# EAGLE design HE6-RORO2 (EAGLE 9.6.2)
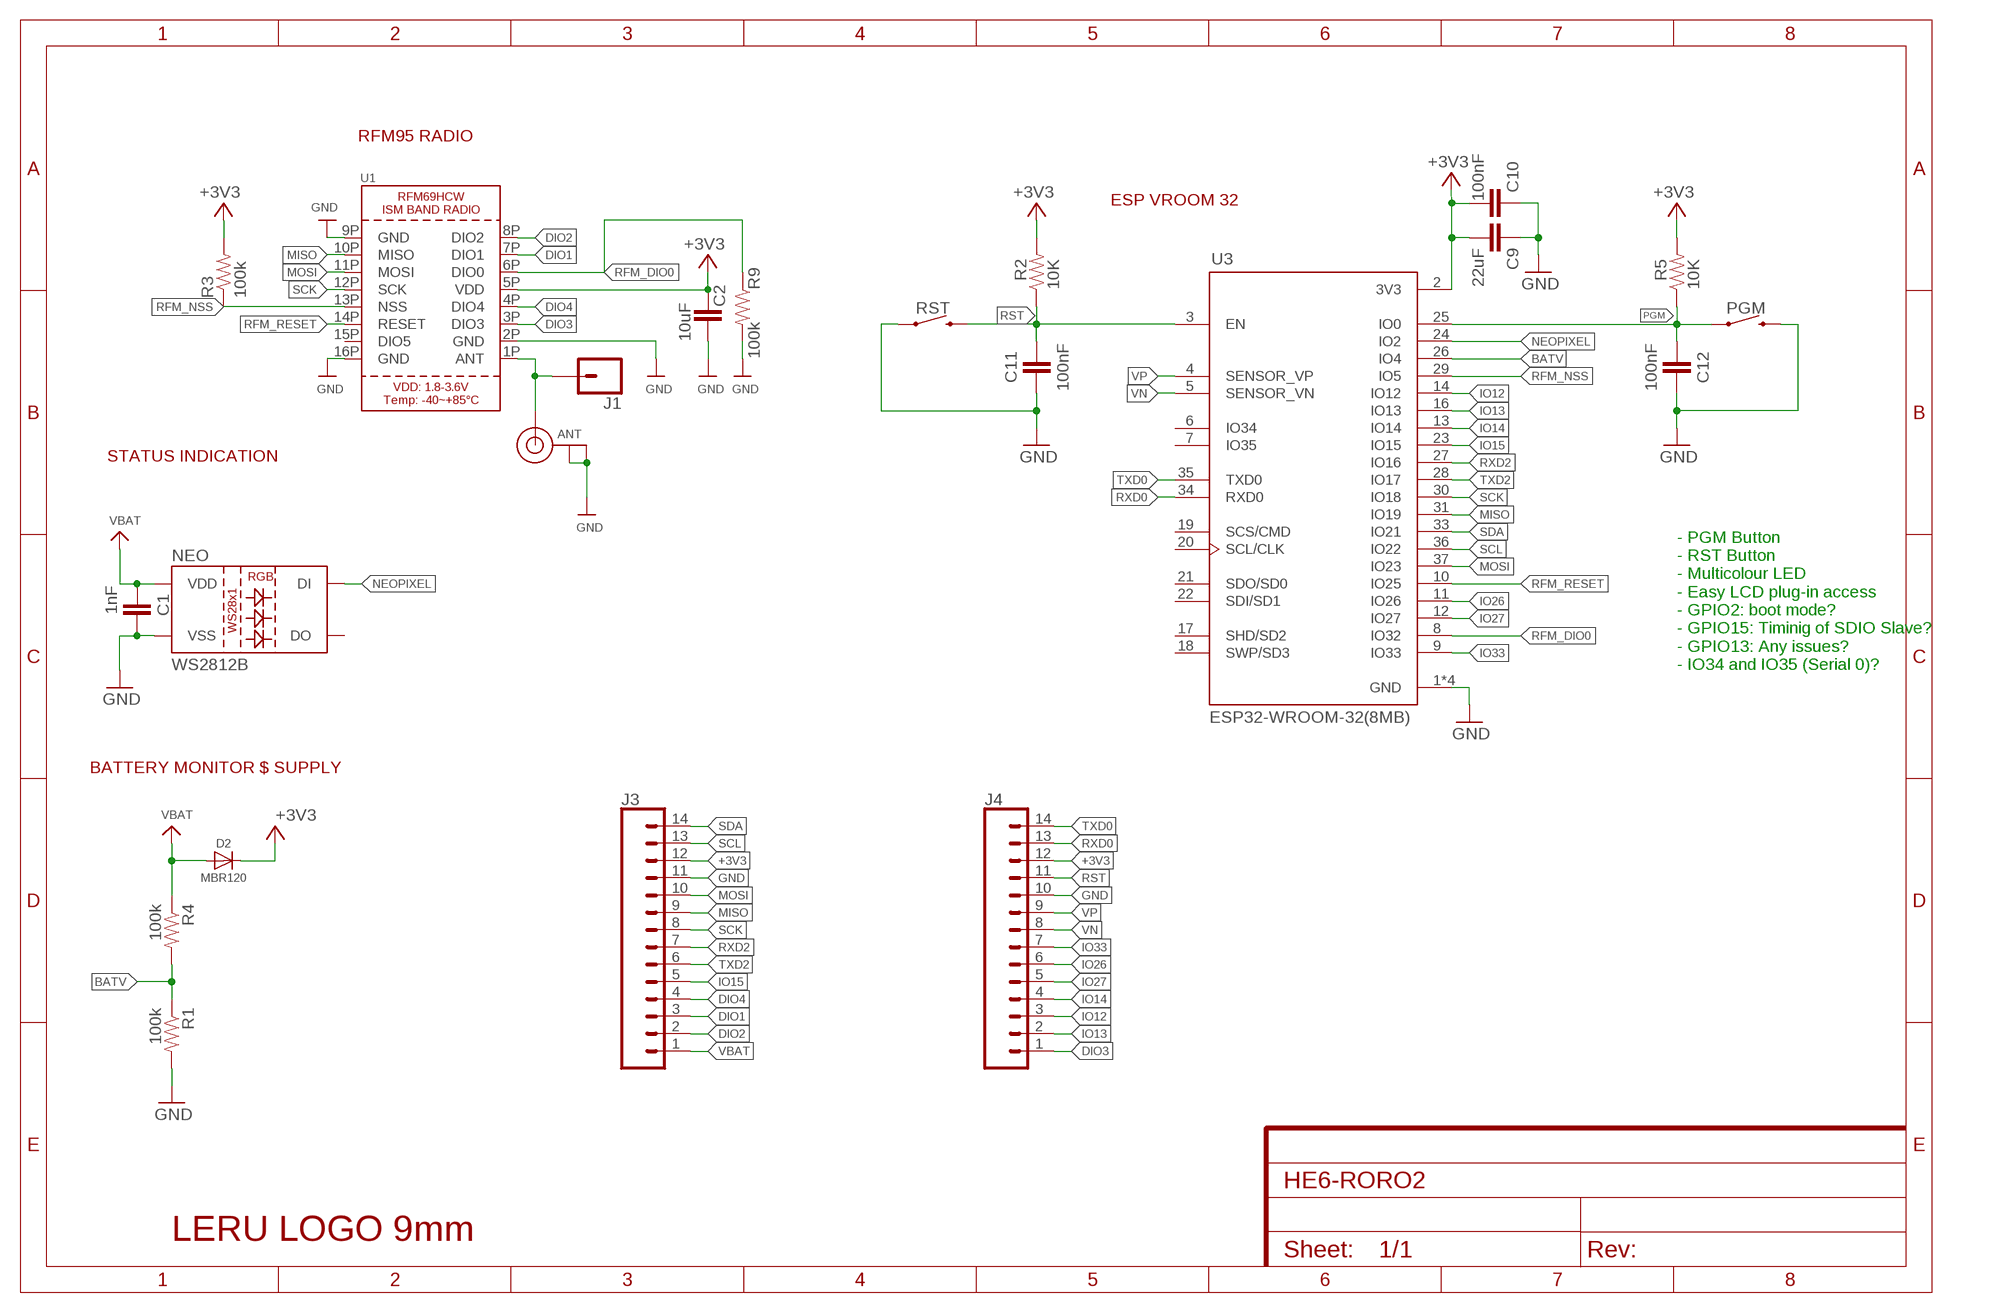
[diagram p0: schematic, sheet 1]

## Parts
ANT  MICROBUILDER_ANTENNA_U.FL  [MICROBUILDER_U.FL]
C1  1nF  CAP0805  [CAP]
C2  10uF  CAP0805  [CAP]
C9  22uF  CAP0805  [CAP]
C10  100nF  CAP0805  [CAP]
C11  100nF  CAP0805  [CAP]
C12  100nF  CAP0805  [CAP]
D2  MBR120  DIODESOD123  [DIODE]
J1  CONN_01PTH_NO_SILK_YES_STOP  [1X01_NO_SILK]
J3  CONN_14NO_SILK  [1X14_NO_SILK]
J4  CONN_14NO_SILK  [1X14_NO_SILK]
NEO  WS2812B  [WS2812B]
PGM  MOMENTARY-SWITCH-SPST-SMD-RIGHT-ANGLE  [TACTILE_SWITCH_SMD_RIGHT_ANGLE]
R1  100k  RES0805-RES  [RES]
R2  10K  RES0805-RES  [RES]
R3  100k  RES0805-RES  [RES]
R4  100k  RES0805-RES  [RES]
R5  10K  RES0805-RES  [RES]
R9  100k  RES0805-RES  [RES]
RST  MOMENTARY-SWITCH-SPST-SMD-RIGHT-ANGLE  [TACTILE_SWITCH_SMD_RIGHT_ANGLE]
U1  RFM69HCW_SMT  [RFMHCW_SMT]
U3  ESP32-WROOM-32(8MB)  [MODULE_ESP32-WROOM-32(8MB)]
U$9  LERU_LOGO_9MM  [LERU_LOGO_9MM]

## Nets
+3V3: C2.1 C9.2 C10.2 D2.1(C) J3.12 J4.12 R2.2 R3.2 R5.2 U1.5P(VDD) U3.2(3V3)
BATV: R1.1 R4.2 U3.26(IO4)
DIO1: J3.3 U1.7P(DIO1)
DIO2: J3.2 U1.8P(DIO2)
DIO3: J4.1 U1.3P(DIO3)
DIO4: J3.4 U1.4P(DIO4)
GND: ANT.1(GND) ANT.2(GND) C1.1 C2.2 C9.1 C10.1 C11.1 C12.1 J3.11 J4.10 NEO.3(VSS) PGM.2 R1.2 R9.2 RST.1 U1.2P(GND) U1.9P(GND) U1.16P(GND) U3.1(GND) U3.15(GND) U3.38(GND) U3.39(GND)
IO12: J4.3 U3.14(IO12)
IO13: J4.2 U3.16(IO13)
IO14: J4.4 U3.13(IO14)
IO15: J3.5 U3.23(IO15)
IO26: J4.6 U3.11(IO26)
IO27: J4.5 U3.12(IO27)
IO33: J4.7 U3.9(IO33)
MISO: J3.9 U1.10P(MISO) U3.31(IO19)
MOSI: J3.10 U1.11P(MOSI) U3.37(IO23)
N$1: ANT.3(SIGNAL) J1.1 U1.1P(ANT)
NEOPIXEL: NEO.4(DI) U3.24(IO2)
PGM: C12.2 PGM.1 R5.1 U3.25(IO0)
RFM_DIO0: R9.1 U1.6P(DIO0) U3.8(IO32)
RFM_NSS: R3.1 U1.13P(NSS) U3.29(IO5)
RFM_RESET: U1.14P(RESET) U3.10(IO25)
RST: C11.2 J4.11 R2.1 RST.2 U3.3(EN)
RXD0: J4.13 U3.34(RXD0)
RXD2: J3.7 U3.27(IO16)
SCK: J3.8 U1.12P(SCK) U3.30(IO18)
SCL: J3.13 U3.36(IO22)
SDA: J3.14 U3.33(IO21)
TXD0: J4.14 U3.35(TXD0)
TXD2: J3.6 U3.28(IO17)
VBAT: C1.2 D2.2(A) J3.1 NEO.1(VDD) R4.1
VN: J4.8 U3.5(SENSOR_VN)
VP: J4.9 U3.4(SENSOR_VP)
Unconnected: NEO.2(DO) U1.15P(DIO5) U3.6(IO34) U3.7(IO35) U3.17(SHD/SD2) U3.18(SWP/SD3) U3.19(SCS/CMD) U3.20(SCL/CLK) U3.21(SDO/SD0) U3.22(SDI/SD1)

## Notes on the sheet
- RFM95 RADIO
- ESP VROOM 32
- STATUS INDICATION
- - PGM Button
  - RST Button
  - Multicolour LED
  - Easy LCD plug-in access
  - GPIO2: boot mode?
  - GPIO15: Timinig of SDIO Slave?
  - GPIO13: Any issues?
  - IO34 and IO35 (Serial 0)?
- BATTERY MONITOR $ SUPPLY

## Library data of the parts
ANT = A-3-7-1-2-80:MICROBUILDER_ANTENNA_U.FL: U.FL Antenna Connector
C1 C2 C9-C12 = JLR:CAP: Capacitor Standard 0603 ceramic capacitor, and 0.1" leaded capacitor.
D2 = JLR:DIODE: DIODE unfilled
J1 = SparkFun-Connectors:CONN_01: Single connection point. Often used as Generic Header-pin footprint for 0.1 inch spaced/style header connections On any of the 0.1 inch spaced packages, you can populate with these: Break Away Headers - Straight <https://www.sparkfun.com/products/116> (PRT-00116) Break Away Male Headers - Right Angle <https://www.sparkfun.com/products/553> (PRT-00553) Female Headers <https://www.sparkfun.com/products/115> (PRT-00115) Break Away Headers - Machine Pin <https://www.sparkfun.com/products/117> (PRT-00117) Break Away Female Headers - Swiss Machine Pin <https://www.sparkfun.com/products/743> (PRT-00743) This device is also useful as a general connection point to wire up your design to another part of your project. Our various solder wires solder well into these plated through hole pads. Hook-Up Wire - Assortment (Stranded, 22 AWG) <https://www.sparkfun.com/products/11375> (PRT-11375) Hook-Up Wire - Assortment (Solid Core, 22 AWG) <https://www.sparkfun.com/products/11367> (PRT-11367) View the entire wire category on our website here <https://www.sparkfun.com/categories/141> Special notes: SMTSO-256-ET is a "flush mount" nut for a 4-40 screw. We mostly use this on specialty testbeds; it is a nice way to connect hardware to your PCB at an adjustable hieght. Also note, the SNAP packages are for using a snappable style connector. We sell a baggie of snaps and they are also used on two LilyPad designs: Snap Assortment - 30 pack (male and female) <https://www.sparkfun.com/products/11347> (DEV-11347) LilyPad Arduino SimpleSnap <https://www.sparkfun.com/products/10941> (DEV-10941) LilyPad SimpleSnap Protoboard <https://www.sparkfun.com/products/10940> (DEV-10940)
J3 J4 = SparkFun-Connectors:CONN_14: Multi connection point. Often used as Generic Header-pin footprint for 0.1 inch spaced/style header connections On any of the 0.1 inch spaced packages, you can populate with these: Break Away Headers - Straight <https://www.sparkfun.com/products/116> (PRT-00116) Break Away Male Headers - Right Angle <https://www.sparkfun.com/products/553> (PRT-00553) Female Headers <https://www.sparkfun.com/products/115> (PRT-00115) Break Away Headers - Machine Pin <https://www.sparkfun.com/products/117> (PRT-00117) Break Away Female Headers - Swiss Machine Pin <https://www.sparkfun.com/products/743> (PRT-00743) For SCREWTERMINALS and SPRING TERMINALS visit here: Screw Terimnals on SparkFun.com <https://www.sparkfun.com/search/results?term=Screw+Terminals> (5mm/3.5mm/2.54mm spacing) This device is also useful as a general connection point to wire up your design to another part of your project. Our various solder wires solder well into these plated through hole pads. Hook-Up Wire - Assortment (Stranded, 22 AWG) <https://www.sparkfun.com/products/11375> (PRT-11375) Hook-Up Wire - Assortment (Solid Core, 22 AWG) <https://www.sparkfun.com/products/11367> (PRT-11367) View the entire wire category on our website here <https://www.sparkfun.com/categories/141> Special notes: Molex polarized connector foot print use with SKU : PRT-08231 with associated crimp pins and housings. 1MM SMD Version SKU: PRT-10208 NOTES ON THE VARIANTS LOCK and LOCK_LONGPADS... This footprint was designed to help hold the alignment of a through-hole component (i.e. 6-pin header) while soldering it into place. You may notice that each hole has been shifted either up or down by 0.005 of an inch from it's more standard position (which is a perfectly straight line). This slight alteration caused the pins (the squares in the middle) to touch the edges of the holes. Because they are alternating, it causes a "brace" to hold the component in place. 0.005 has proven to be the perfect amount of "off-center" position when using our standard breakaway headers. Although looks a little odd when you look at the bare footprint, once you have a header in there, the alteration is very hard to notice. Also,if you push a header all the way into place, it is covered up entirely on the bottom side.
NEO = SparkFun-LED:WS2812B: WS2812B SMD addressable RGB LED 5x5mm SMD LED with built-in controller IC. Color: Red/Green/Blue mC Rating: RGB: 390, 660, 180 mcd Forward Voltage: RGB: 2.0, 3.0, 3.0 V Packages:WS2812B SparkFun Products: Blynk Board - ESP8266 <https://www.sparkfun.com/products/13794>; PROD_ID: DIO-12503
PGM RST = SparkFun-Switches:MOMENTARY-SWITCH-SPST: Momentary Switch (Pushbutton) - SPST Normally-open (NO) SPST momentary switches (buttons, pushbuttons). Variants PTH-12MM - 12mm square, through-hole Momentary Pushbutton Switch - 12mm Square <https://www.sparkfun.com/products/9190> (COM-09190) PTH-6.0MM, PTH-6.0MM-KIT - 6.0mm square, through-hole Mini Pushbutton Switch <https://www.sparkfun.com/products/97> (COM-00097) KIT package intended for soldering kit's - only one side of pads' copper is exposed. PTH-RIGHT-ANGLE-KIT - Right-angle, through-hole Right Angle Tactile Button <https://www.sparkfun.com/products/10791> - Used on SparkFun BigTime Watch Kit <https://www.sparkfun.com/products/11734> SMD-12MM - 12mm square, surface-mount Tactile Button - SMD (12mm) <https://www.sparkfun.com/products/12993> (COM-12993) Used on SparkFun PicoBoard <https://www.sparkfun.com/products/11888> SMD-4.5MM - 4.5mm Square Trackball Switch Used on SparkFun Blackberry Trackballer Breakout <https://www.sparkfun.com/products/13169> SMD-4.6MMX2.8MM - 4.60mm x 2.80mm, surface mount Used on SparkFun SAMD21 Mini Breakout <https://www.sparkfun.com/products/13664> SMD-5.2MM, SMD-5.2-REDUNDANT - 5.2mm square, surface-mount Mini Pushbutton Switch - SMD <https://www.sparkfun.com/products/8720> (COM-08720) Used on Arduino Pro Mini <https://www.sparkfun.com/products/11114> REDUNDANT package connects both switch circuits together SMD-6.0X3.5MM - 6.0 x 3.5mm, surface mount Momentary Reset Switch SMD <https://www.sparkfun.com/products/8229> (COM-08229) SMD-6.2MM-TALL - 6.2mm square, surface mount Tactile Button - SMD (6mm) <https://www.sparkfun.com/products/12992> Used on SparkFun Digital Sandbox <https://www.sparkfun.com/products/12651> SMD-RIGHT-ANGLE - Right-angle, surface mount Used on SparkFun Block for Intel® Edison - Arduino <https://www.sparkfun.com/products/13036>; PROD_ID: COMP-12265
R1-R5 R9 = JLR:RES: Resistor Basic schematic elements and footprints for 0603, 1206, and PTH resistors.
U1 = microbuilder:RFM69HCW: RFM69HCW - ISM Band RF Transceiver
U3 = ESP32-WROOM-32_8MB_:ESP32-WROOM-32(8MB): WIFI MODULE 64 MBITS SPI FLASH; AVAILABILITY: Unavailable; DESCRIPTION: Bluetooth, WiFi 802.11b/g/n, Bluetooth v4.2 + EDR, Class 1, 2 and 3 Transceiver Module 2.4GHz ~ 2.5GHz Surface Mount; MF: Espressif Systems; MP: ESP32-WROOM-32 _8MB_; PACKAGE: Module Espressif Systems; PRICE: None
U$9 = JLR:LERU_LOGO_9MM

## Net classes
1 vcc: width 0.254 mm

## Board
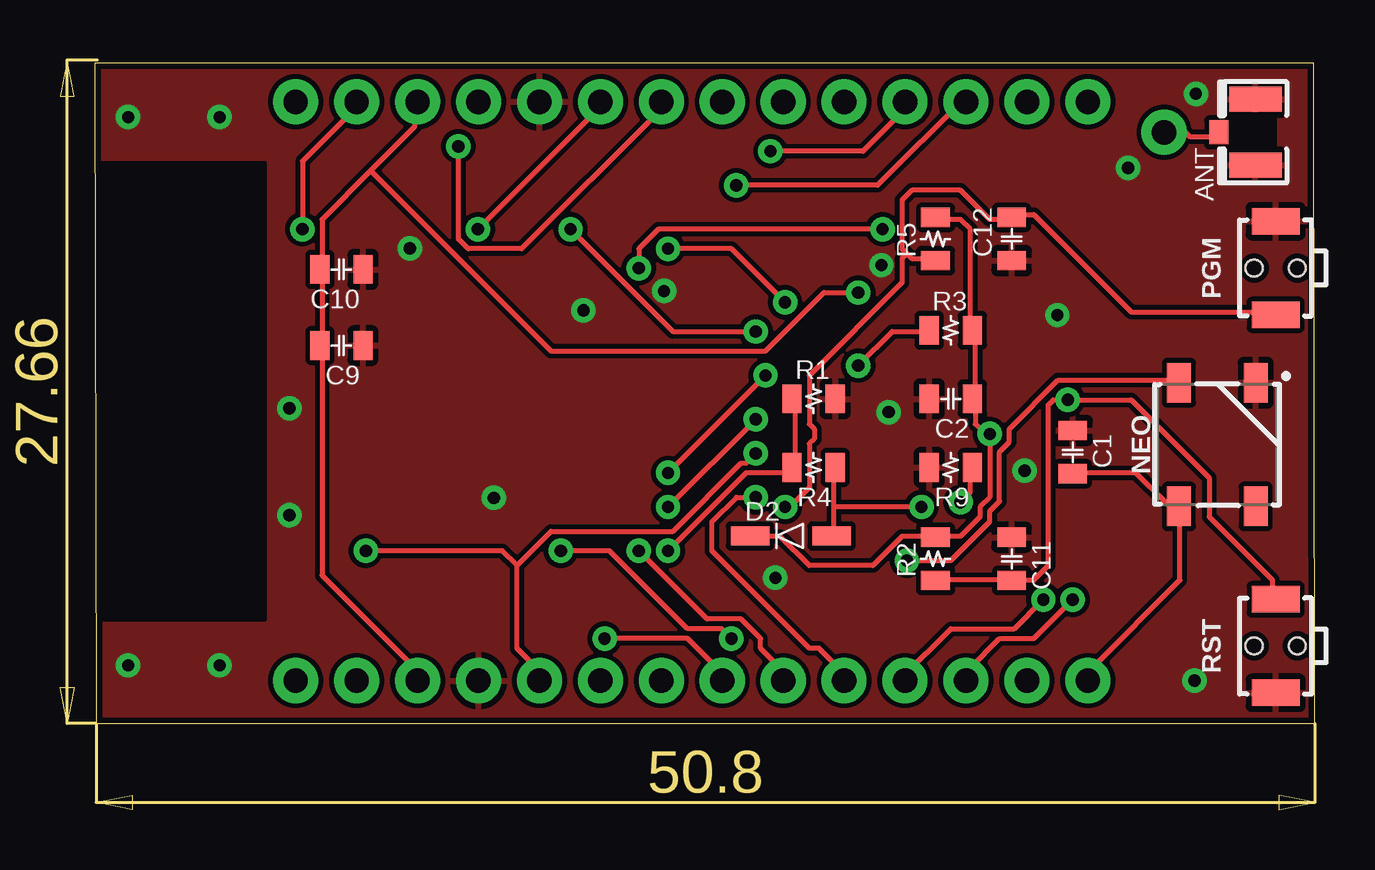
[diagram p1: board, top side]
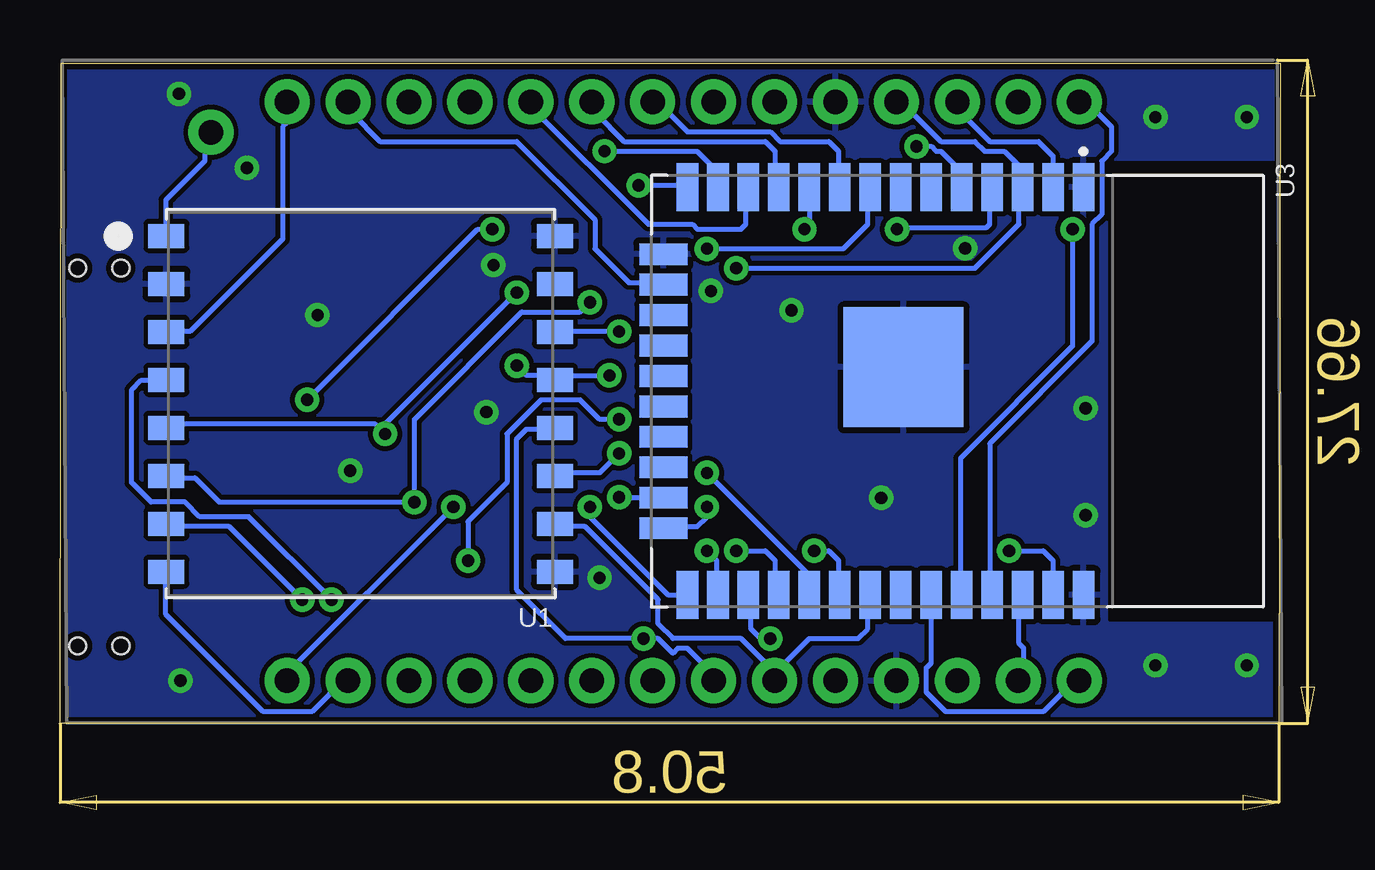
[diagram p2: board, bottom side, seen from below]

Size 50.86 x 27.52 mm. Coordinates in mm from the lower left corner, seen from the top.
Outline: 0.06,0 50.86,0 50.8,27.52 0,27.52 0.06,0
Copper layers (1*16): Top 0.035mm / dielectric 1.5mm / Bottom 0.035mm
Design rules "SparkFun": minimum track width 8mil, minimum drill 20mil, track to track 8mil, track to pad 8mil, pad to pad 8mil, via to via 8mil, smd to smd 8mil, copper to edge 10mil, drill to drill 8mil, minimum pad ring 12mil, minimum via ring 10mil, stop-mask expansion 4mil, vias tented up to drill 25mil, thermal gap 10mil
tRestrict: area 0.1,4.3 to 7.1,23.4
bRestrict: area 0.1,4.3 to 7.1,23.4

### Footprints (pad centres in the part's own frame; a part is rotated, then mirrored left to right if it is on the bottom)
MICROBUILDER_U.FL = smd 2.2 x 1.05: 1 0,1.375; 2 0,-1.375 | smd 0.8 x 1: 3 1.525,0
CAP = smd 0.8 x 1.2: 1 -0.9,0; 2 0.9,0
DIODE = smd 1.6 x 0.8: 1 -1.7,0; 2 1.7,0
1X01_NO_SILK = drill 1.016 pad 1.88: 1 0,0
1X14_NO_SILK = drill 1.016 pad 1.88: 1 0,0; 2 2.54,0; 3 5.08,0; 4 7.62,0; 5 10.16,0; 6 12.7,0; 7 15.24,0; 8 17.78,0; 9 20.32,0; 10 22.86,0; 11 25.4,0; 12 27.94,0; 13 30.48,0; 14 33.02,0
WS2812B = smd 1.651 x 1: 1 2.577,-1.6; 2 2.577,1.6; 3 -2.577,1.6; 4 -2.577,-1.6
TACTILE_SWITCH_SMD_RIGHT_ANGLE = smd 1.1 x 2: 1 -1.95,0; 2 1.95,0 | hole 0.7: 0,0.9; 0,-0.9
RES = smd 0.8 x 1.2: 1 -0.9,0; 2 0.9,0
RFMHCW_SMT = smd 1.5 x 1: 1P 8.1,-7; 2P 8.1,-5; 3P 8.1,-3; 4P 8.1,-1; 5P 8.1,1; 6P 8.1,3; 7P 8.1,5; 8P 8.1,7; 9P -8.1,7; 10P -8.1,5; 11P -8.1,3; 12P -8.1,1; 13P -8.1,-1; 14P -8.1,-3; 15P -8.1,-5; 16P -8.1,-7
MODULE_ESP32-WROOM-32(8MB) = smd 2 x 0.9: 1 -8.5,5.26; 2 -8.5,3.99; 3 -8.5,2.72; 4 -8.5,1.45; 5 -8.5,0.18; 6 -8.5,-1.09; 7 -8.5,-2.36; 8 -8.5,-3.63; 9 -8.5,-4.9; 10 -8.5,-6.17; 11 -8.5,-7.44; 12 -8.5,-8.71; 13 -8.5,-9.98; 14 -8.5,-11.25; 25 8.5,-11.25; 26 8.5,-9.98; 27 8.5,-8.71; 28 8.5,-7.44; 29 8.5,-6.17; 30 8.5,-4.9; 31 8.5,-3.63; 32 8.5,-2.36; 33 8.5,-1.09; 34 8.5,0.18; 35 8.5,1.45; 36 8.5,2.72; 37 8.5,3.99; 38 8.5,5.26 | smd 0.9 x 2: 15 -5.715,-12.25; 16 -4.445,-12.25; 17 -3.175,-12.25; 18 -1.905,-12.25; 19 -0.635,-12.25; 20 0.635,-12.25; 21 1.905,-12.25; 22 3.175,-12.25; 23 4.445,-12.25; 24 5.715,-12.25 | smd 5 x 5: 39 -1,-2.24

### Placement (x,y rotation side)
ANT  48.38,24.64 180 top
C1  40.76,11.31 270 top
C2  35.68,13.53 180 top
C9  10.28,15.76 180 top
C10  10.28,18.93 180 top
C11  38.22,6.87 270 top
C12  38.22,20.2 90 top
D2  29.01,7.82 0 top
J1  44.57,24.64 0 top
J3  41.39,1.79 180 top
J4  41.39,25.91 180 top
NEO  46.79,11.63 270 top
PGM  49.22,18.98 90 top
R1  29.96,13.53 0 top
R2  35.04,6.87 90 top
R3  35.68,16.39 0 top
R4  29.96,10.68 180 top
R5  35.04,20.2 90 top
R9  35.68,10.68 180 top
RST  49.22,3.23 90 top
U1  38.32,13.33 180 bottom
U3  13.46,13.85 270 bottom
U$9  13.96,9.91 0 top

### Tracks (layer width: path | path; a pad name or v marks a point on that pad's centre or on a via)
+3V3  (via drill 0.51)
  Top 0.203: R5.2 35.07,21.01 36.09,21.01 36.49,20.61 36.49,16.54 R3.2 36.7,16.34 36.7,13.7 C2.1 36.7,13.49 36.7,12.48 37.1,12.07 v37.31,12.07 v37.3,12.07 37.3,9.43 36.9,9.02 36.9,8.62 36.09,7.8 35.07,7.8 R2.2 34.87,7.8 33.65,7.8 32.43,6.59 29.79,6.59 28.57,7.8 27.35,7.8 D2.1 | 11.5,23.04 13.33,24.87 13.33,25.89 J4.12 | 11.5,23.04 9.47,21.01 9.47,18.98 C10.2 9.47,18.78 9.47,15.93 C9.2 9.47,15.73 9.47,6.18 13.33,2.32 13.33,1.91 J3.12 | v31.82,17.96 30.4,17.96 27.96,15.53 19.02,15.53 11.5,23.04
  Bottom 0.203: 37.51,12.28 37.71,12.48 46.25,12.48 U1.5P | U3.2 9.47,22.43 9.47,23.65 10.08,24.26 12.11,24.26 13.33,25.48 13.33,25.89 J4.12 | v31.82,17.96 37.51,12.28 | 37.51,12.28 v37.31,12.07
BATV  (via drill 0.51)
  Top 0.203: R1.1 29.18,13.49 29.18,10.85 R4.2 28.97,10.65 28.77,10.45 27.15,10.45 v23.89,7.2
  Bottom 0.203: v23.89,7.2 23.49,6.79 23.49,5.37 U3.26
DIO1  (via drill 0.51)
  Top 0.203: v40.76,5.16 39.13,3.54 37.71,3.54 36.49,2.32 36.49,1.91 J3.3
  Bottom 0.203: v40.76,5.16 43.81,8.21 46.25,8.21 U1.7P
DIO2
  Bottom 0.203: U1.8P 46.45,6.18 46.45,4.55 42.39,0.49 40.35,0.49 38.93,1.91 J3.2
DIO3
  Bottom 0.203: U1.3P 46.25,16.34 45.43,16.34 41.57,20.2 41.57,24.87 41.37,25.08 41.37,25.89 J4.1
DIO4  (via drill 0.51)
  Top 0.203: v39.54,5.16 38.32,3.94 35.68,3.94 33.65,1.91 J3.4
  Bottom 0.203: v39.54,5.16 42.99,8.62 45.03,8.62 45.64,9.23 47.06,9.23 47.87,10.04 47.87,13.9 47.47,14.31 46.45,14.31 U1.4P
GND  (via drill 0.51)
  other vias: 16.63,9.41 1.39,25.28 5.2,25.28 8.11,13.14 8.11,8.68 5.2,2.42 1.39,2.42 45.84,1.79 43.07,23.16 45.9,26.25 33.09,12.98 28.37,6.07 38.76,10.54 32.79,19.11 23.73,18.03 20.37,17.22 13.13,19.81 40.12,17.02
  pour Bottom: -0.52,28.21 51.55,28.21 51.55,-0.46 -0.52,-0.46
  pour Top: -0.52,28.22 51.55,28.22 51.55,-0.43 -0.52,-0.43
IO12  (via drill 0.51)
  Top 0.203: v26.74,22.43 32.63,22.43 36.29,26.09 J4.3
  Bottom 0.203: v26.74,22.43 24.71,22.43 U3.14
IO13
  Bottom 0.203: U3.16 25.72,18.37 27.15,18.37 28.57,19.79 28.57,21.01 31.82,24.26 37.51,24.26 38.73,25.48 38.73,25.89 J4.2
IO14  (via drill 0.51)
  Top 0.203: v28.16,23.86 32.02,23.86 33.65,25.48 33.65,25.89 J4.4
  Bottom 0.203: v28.16,23.86 24.3,23.86 23.49,23.04 23.49,22.43 U3.13
IO15  (via drill 0.51)
  Top 0.203: v27.55,9.43 26.74,9.43 25.72,8.41 25.72,7.2 29.79,3.13 30.19,3.13 31.41,1.91 J3.5
  Bottom 0.203: v27.55,9.43 25.72,9.43 U3.23
IO26
  Bottom 0.203: U3.11 21.05,22.43 21.05,23.86 21.46,24.26 27.35,24.26 28.57,25.48 28.57,25.89 J4.6
IO27
  Bottom 0.203: U3.12 22.27,22.23 22.27,20.81 22.47,20.61 24.3,20.61 24.5,20.81 26.33,20.81 31.41,25.89 J4.5
IO33
  Bottom 0.203: U3.9 18.41,22.43 18.41,23.86 18.81,24.26 20.85,24.26 21.25,24.67 24.71,24.67 26.13,26.09 J4.7
MISO
  Bottom 0.203: 21.25,1.91 21.25,2.32 22.47,3.54 25.32,3.54 25.93,4.15 25.93,5.16 28.97,8.21 30.19,8.21 U1.10P | 21.25,1.91 19.63,3.54 17.6,3.54 17.19,3.94 17.19,5.16 U3.31 | 21.25,1.91 J3.9
MOSI  (via drill 0.51)
  Top 0.203: v27.55,11.26 27.15,10.85 26.94,10.85 24.1,8.01 19.02,8.01 17.6,6.59 | 17.6,6.59 17.6,3.13 18.41,2.32 18.41,1.91 J3.10 | v11.3,7.2 16.99,7.2 17.6,6.59
  Bottom 0.203: v27.55,11.26 28.37,10.45 30.19,10.45 U1.11P | v11.3,7.2 9.87,7.2 9.47,6.79 9.47,5.37 U3.37
N$1
  Top 0.203: ANT.3 46.65,24.47 45.64,24.47 45.43,24.67 44.62,24.67 J1.1
  Bottom 0.203: U1.1P 46.45,20.4 46.45,21.83 44.82,23.45 44.82,24.26 44.62,24.47 J1.1
NEOPIXEL  (via drill 0.51)
  Top 0.203: v33.85,6.79 35.68,6.79 37.31,8.41 37.31,8.77 37.31,8.82 37.31,8.86 37.71,9.26 37.71,11.33 38.12,11.74 38.12,12.28 40.15,14.31 45.03,14.31 NEO.4 | v23.89,9.02 v27.55,12.68
  Bottom 0.203: v33.85,6.79 33.85,8.41 32.23,10.04 32.23,12.07 30.8,13.49 29.18,13.49 28.37,12.68 v27.55,12.68 | v23.89,9.02 23.89,8.62 24.3,8.21 25.52,8.21 U3.24
PGM  (via drill 0.51)
  Top 0.203: 33.85,19.59 33.65,19.79 33.65,21.83 34.05,22.23 36.09,22.23 37.31,21.01 38.12,21.01 C12.2 38.32,21.22 39.13,21.22 43.2,17.15 49.09,17.15 PGM.1 | 33.85,19.59 34.05,19.39 34.87,19.39 R5.1 | v28.77,9.02 28.97,9.02 29.79,9.84 29.79,11.67 29.99,11.87 29.99,12.28 29.79,12.48 29.79,14.51 33.65,18.37 33.65,19.39 33.85,19.59
  Bottom 0.203: v28.77,9.02 28.77,8.62 25.52,5.37 24.71,5.37 U3.25
RFM_DIO0  (via drill 0.51)
  Top 0.203: v36.09,9.23 36.49,9.63 36.49,10.65 R9.1 | v23.89,19.79 26.54,19.79 v28.77,17.56
  Bottom 0.203: U1.6P 46.25,10.24 45.23,10.24 44.21,9.23 v36.09,9.23 36.09,12.68 31.62,17.15 29.18,17.15 v28.77,17.56 | v23.89,19.79 18.21,19.79 17.19,20.81 17.19,22.23 U3.8
RFM_NSS  (via drill 0.51)
  Top 0.203: v31.82,14.92 33.24,16.34 34.66,16.34 R3.1 | v27.96,14.51 v23.89,10.45
  Bottom 0.203: v31.82,14.92 31.41,14.51 30.4,14.51 U1.13P 30.19,14.51 v27.96,14.51 | v23.89,10.45 19.63,6.18 19.63,5.37 U3.29
RFM_RESET  (via drill 0.51)
  Top 0.203: v27.55,16.34 24.1,16.34 v19.83,20.61
  Bottom 0.203: v27.55,16.34 30.19,16.34 U1.14P | v19.83,20.61 19.83,20.81 19.63,21.01 19.63,22.23 U3.10
RST  (via drill 0.51)
  Top 0.203: R2.1 35.07,5.98 38.12,5.98 C11.2 38.32,5.98 39.13,5.98 39.74,6.59 39.74,8.41 39.74,8.42 39.74,13.29 39.95,13.49 v40.56,13.49 43.2,13.49 46.45,10.24 46.45,8.62 49.09,5.98 49.09,5.37 RST.2 | v22.68,18.98 22.68,19.79 23.49,20.61 v32.84,20.61
  Bottom 0.203: J4.11 15.97,26.09 14.14,24.26 12.72,24.26 12.31,23.86 11.5,23.86 10.89,23.25 10.89,22.43 U3.3 10.89,22.23 10.89,20.81 12.72,18.98 v22.68,18.98 | v32.84,20.61 33.45,20.61 v40.56,13.49
RXD0  (via drill 0.51)
  Top 0.203: v8.65,20.61 8.65,23.45 11.09,25.89 J4.13
  Bottom 0.203: v8.65,20.61 8.65,15.73 13.33,11.06 13.33,5.37 U3.34
RXD2  (via drill 0.51)
  Top 0.203: v21.25,3.54 24.71,3.54 26.33,1.91 J3.7
  Bottom 0.203: v21.25,3.54 21.66,3.54 22.07,3.94 22.07,5.16 U3.27
SCK  (via drill 0.51)
  Top 0.203: v19.42,7.2 21.46,7.2 24.71,3.94 26.13,3.94 v26.54,3.54
  Bottom 0.203: U1.12P 30.4,12.28 31.41,12.28 31.82,11.87 31.82,5.57 29.79,3.54 v26.54,3.54 25.93,3.54 25.32,2.93 25.11,3.13 24.71,3.13 23.49,1.91 J3.8 | v19.42,7.2 18.81,7.2 18.41,6.79 18.41,5.37 U3.30
SCL
  Bottom 0.203: U3.36 10.89,5.16 10.89,3.33 10.69,3.13 10.69,2.11 10.89,1.91 J3.13
SDA
  Bottom 0.203: U3.33 14.55,5.16 14.55,2.52 14.75,2.32 14.75,1.3 13.94,0.49 9.87,0.49 8.45,1.91 J3.14
TXD0
  Bottom 0.203: U3.35 12.11,5.37 12.11,11.67 7.84,15.93 7.84,20.81 7.44,21.22 7.44,23.45 7.03,23.86 7.03,24.87 8.25,26.09 J4.14
TXD2  (via drill 0.51)
  Top 0.203: v22.68,7.2 25.52,4.35 26.94,4.35 27.76,3.54 27.76,3.13 28.57,2.32 28.57,1.91 J3.6
  Bottom 0.203: v22.68,7.2 21.46,7.2 21.05,6.79 21.05,5.37 U3.28
VBAT  (via drill 0.51)
  Top 0.203: C1.2 40.76,10.45 43.4,10.45 44.62,9.23 45.03,9.23 NEO.1 45.23,9.02 45.23,5.98 41.57,2.32 41.57,1.91 J3.1 | 30.8,9.02 30.8,8.01 D2.2 | 30.8,9.02 30.8,10.65 R4.1 | v34.46,9.02 30.8,9.02
  Bottom 0.203: v34.46,9.02 41.57,1.91 J3.1
VN  (via drill 0.51)
  Top 0.203: v15.16,24.06 15.16,20.2 15.56,19.79 17.8,19.79 23.49,25.48 23.49,25.89 J4.8
  Bottom 0.203: v15.16,24.06 14.55,24.06 14.34,23.86 14.14,23.86 13.33,23.04 13.33,22.43 U3.5
VP  (via drill 0.51)
  Top 0.203: v15.97,20.61 21.25,25.89 J4.9
  Bottom 0.203: v15.97,20.61 15.9,20.68 12.24,20.68 12.11,20.81 12.11,22.23 U3.4

### Text on the board
tDocu: TXD0 | RXD0 | 3V3 | RST | GND | VP | VN | IO33 | IO26 | IO27 | IO14 | IO12 | IO13 | DIO3 | HE6-RORO2 | SDA | SCL | 3V3 | GND | MOSI | MISO | SCK | RXD2 | TXD2 | IO15 | DIO4 | DIO1 | DIO2 | VBAT